# EAGLE schematic Logic_start (EAGLE 9.6.2)
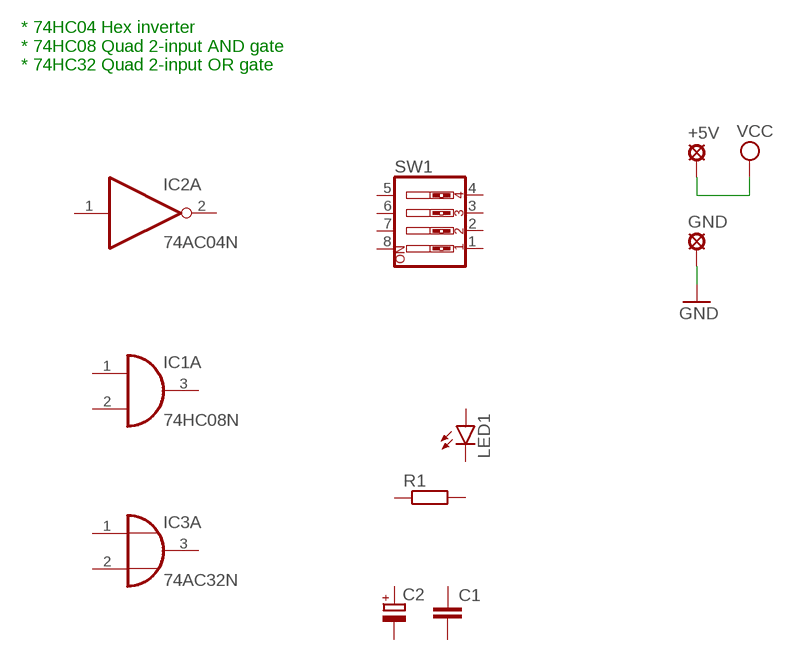
[diagram p0: schematic, sheet 1]

## Parts
+5V  LSP11  [LSP11]
C1  C-EUC1206  [C1206]
C2  CPOL-EUE3.5-8  [E3,5-8]
GND  LSP11  [LSP11]
IC1  74HC08N  [DIL14]
IC2  74AC04N  [DIL14]
IC3  74AC32N  [DIL14]
LED1  LED5MM  [LED5MM]
R1  R-EU_0309/10  [0309/10]
SW1  SW_DIP-4  [EDG-04]

## Nets
GND: GND.MP
VCC: +5V.MP
Unconnected: C1.1 C1.2 C2.+ C2.- IC1.1(A:I0) IC1.2(A:I1) IC1.3(A:O) IC1.4(B:I0) IC1.5(B:I1) IC1.6(B:O) IC1.8(C:O) IC1.9(C:I0) IC1.10(C:I1) IC1.11(D:O) IC1.12(D:I0) IC1.13(D:I1) IC2.1(A:I) IC2.2(A:O) IC2.3(B:I) IC2.4(B:O) IC2.5(C:I) IC2.6(C:O) IC2.8(D:O) IC2.9(D:I) IC2.10(E:O) IC2.11(E:I) IC2.12(F:O) IC2.13(F:I) IC3.1(A:I0) IC3.2(A:I1) IC3.3(A:O) IC3.4(B:I0) IC3.5(B:I1) IC3.6(B:O) IC3.8(C:O) IC3.9(C:I0) IC3.10(C:I1) IC3.11(D:O) IC3.12(D:I0) IC3.13(D:I1) LED1.A LED1.K(C) R1.1 R1.2 SW1.1 SW1.2 SW1.3 SW1.4 SW1.5 SW1.6 SW1.7 SW1.8

## Notes on the sheet
- * 74HC04	Hex inverter
  * 74HC08	Quad 2-input AND gate
  * 74HC32	Quad 2-input OR gate

## Power pins joined to a net without a drawn wire
GND: IC1.7(P:GND) IC2.7(P:GND) IC3.7(P:GND)
VCC: IC1.14(P:VCC) IC2.14(P:VCC) IC3.14(P:VCC)

## Library data of the parts
+5V GND = solpad:LSP11: SOLDER PAD drill 1.1 mm
C1 = rcl:C-EU: CAPACITOR, European symbol; SPICEPREFIX: C
C2 = rcl:CPOL-EU: POLARIZED CAPACITOR, European symbol; SPICEPREFIX: C
IC1 = 74xx-eu:74*08: Quad 2-input AND gate
IC2 = 74xx-eu:74*04: Hex INVERTER
IC3 = 74xx-eu:74*32: Quad 2-input OR gate
LED1 = led:LED: LED OSRAM: - CHIPLED LG R971, LG N971, LY N971, LG Q971, LY Q971, LO R971, LY R971 LH N974, LH R974 LS Q976, LO Q976, LY Q976 LO Q996 - Hyper CHIPLED LW Q18S LB Q993, LB Q99A, LB R99A - SideLED LS A670, LO A670, LY A670, LG A670, LP A670 LB A673, LV A673, LT A673, LW A673 LH A674 LY A675 LS A676, LA A676, LO A676, LY A676, LW A676 LS A679, LY A679, LG A679 - Hyper Micro SIDELED® LS Y876, LA Y876, LO Y876, LY Y876 LT Y87S - SmartLED LW L88C, LW L88S LB L89C, LB L89S, LG L890 LS L89K, LO L89K, LY L89K LS L896, LA L896, LO L896, LY L896 - TOPLED LS T670, LO T670, LY T670, LG T670, LP T670 LSG T670, LSP T670, LSY T670, LOP T670, LYG T670 LG T671, LOG T671, LSG T671 LB T673, LV T673, LT T673, LW T673 LH T674 LS T676, LA T676, LO T676, LY T676, LB T676, LH T676, LSB T676, LW T676 LB T67C, LV T67C, LT T67C, LS T67K, LO T67K, LY T67K, LW E67C LS E67B, LA E67B, LO E67B, LY E67B, LB E67C, LV E67C, LT E67C LW T67C LS T679, LY T679, LG T679 LS T770, LO T770, LY T770, LG T770, LP T770 LB T773, LV T773, LT T773, LW T773 LH T774 LS E675, LA E675, LY E675, LS T675 LS T776, LA T776, LO T776, LY T776, LB T776 LHGB T686 LT T68C, LB T68C - Hyper Mini TOPLED® LB M676 - Mini TOPLED Santana® LG M470 LS M47K, LO M47K, LY M47K Source: http://www.osram.convergy.de LUXEON: - LUMILED® LXK2-PW12-R00, LXK2-PW12-S00, LXK2-PW14-U00, LXK2-PW14-V00 LXK2-PM12-R00, LXK2-PM12-S00, LXK2-PM14-U00 LXK2-PE12-Q00, LXK2-PE12-R00, LXK2-PE12-S00, LXK2-PE14-T00, LXK2-PE14-U00 LXK2-PB12-K00, LXK2-PB12-L00, LXK2-PB12-M00, LXK2-PB14-N00, LXK2-PB14-P00, LXK2-PB14-Q00 LXK2-PR12-L00, LXK2-PR12-M00, LXK2-PR14-Q00, LXK2-PR14-R00 LXK2-PD12-Q00, LXK2-PD12-R00, LXK2-PD12-S00 LXK2-PH12-R00, LXK2-PH12-S00 LXK2-PL12-P00, LXK2-PL12-Q00, LXK2-PL12-R00 Source: www.luxeon.com KINGBRIGHT: KA-3528ASYC Source: www.kingbright.com
R1 = rcl:R-EU_: RESISTOR, European symbol; SPICEPREFIX: R
SW1 = special:SW_DIP-4: DIP SWITCH